# Altium schematic sheet VoltageRegulator5V.SchDoc
size A
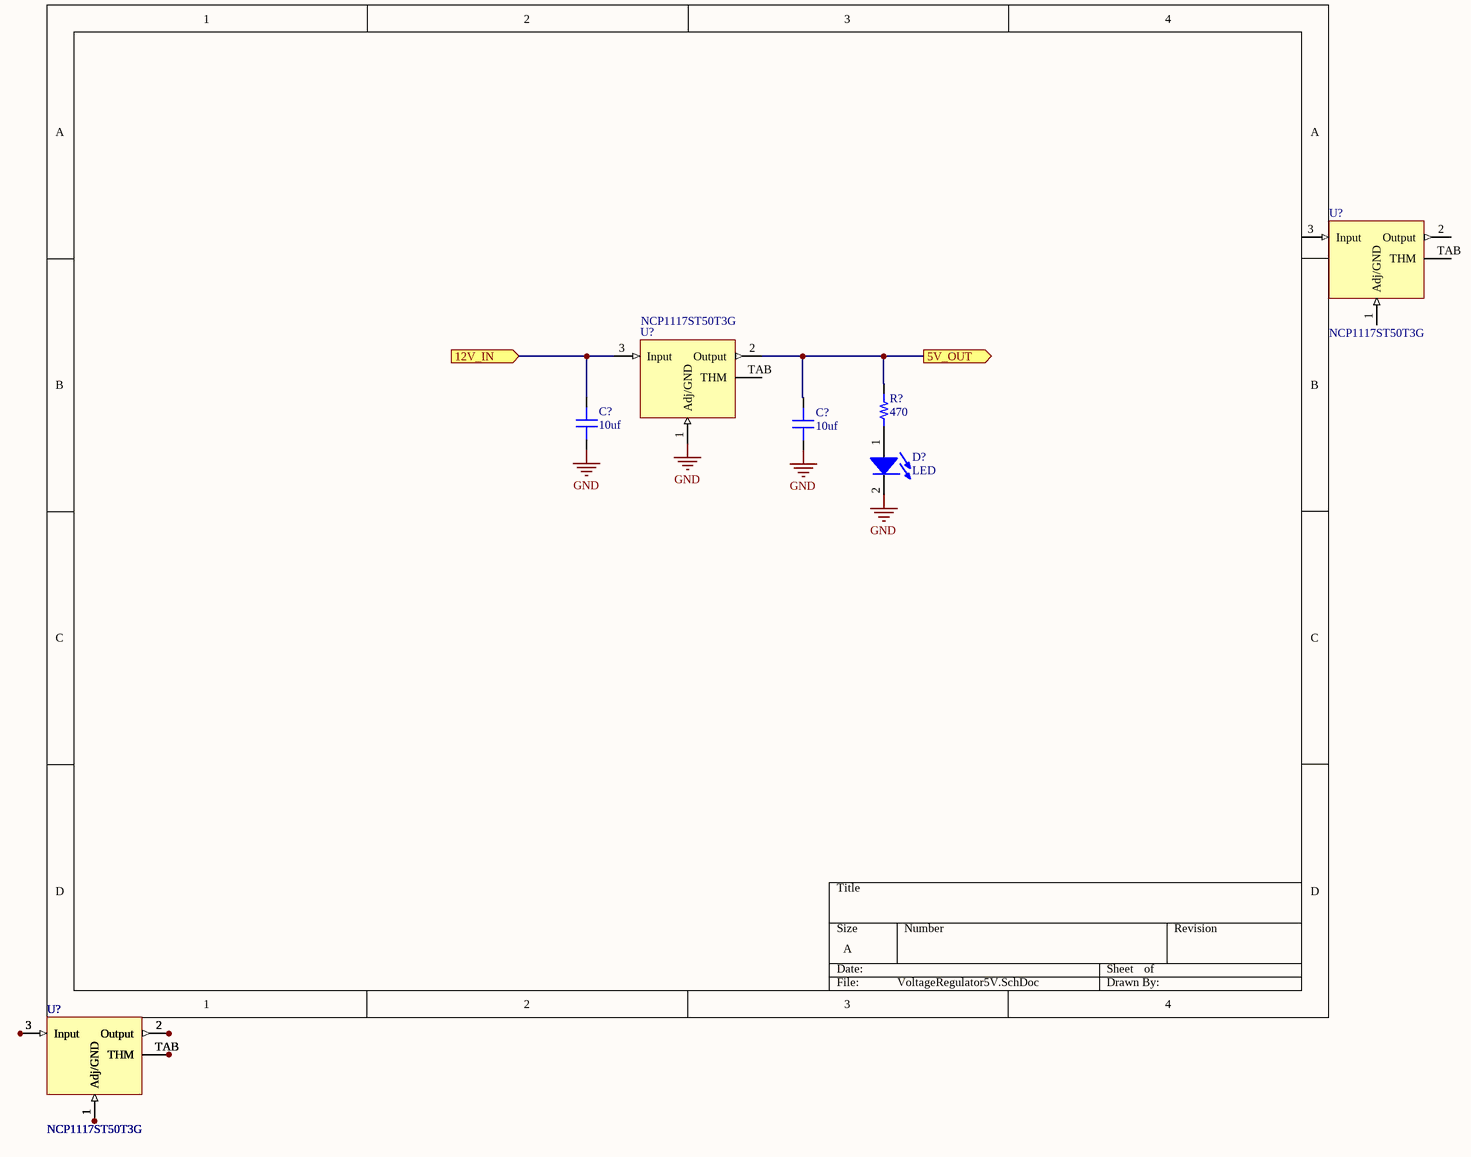
[diagram p0: VoltageRegulator5V.SchDoc]

## Parts
(Parts that share a designator on the sheet are numbered #1, #2 ... from top to bottom, then left to right.)
C?#1  value 10uf  [CAP 0603/1608]  (hidden comment: Capacitor MLCC 10uf 50V CAP 0603/1608)
C?#2  value 10uf  [CAP 0603/1608]  (hidden comment: Capacitor MLCC 10uf 50V CAP 0603/1608)
D?  LED  [0805_LED]
R?  value 470  [RES 0603/1608]  (hidden comment: Resistor 470 0603 1/10W 10%)
U?#1  NCP1117ST50T3G  [SOT-223-3]
U?#2  NCP1117ST50T3G  [SOT-223-3]
U?#3  NCP1117ST50T3G  [SOT-223-3]
U?#4  NCP1117ST50T3G  [SOT-223-3]
U?#5  NCP1117ST50T3G  [SOT-223-3]
U?#6  NCP1117ST50T3G  [SOT-223-3]
U?#7  NCP1117ST50T3G  [SOT-223-3]
U?#8  NCP1117ST50T3G  [SOT-223-3]

## Ports
5V_OUT (out), 12V_IN (in)

## Nets
GND: C?#1.2 C?#2.1 D?.2(K) U?#2.1(Adj/GND)
5V_OUT: C?#2.2 R?.1 U?#2.2(Output) ; port 5V_OUT
12V_IN: C?#1.1 U?#2.3(Input) ; port 12V_IN
NetD?_1: D?.1(A) R?.2
NetU?#3_1: U?#3.1(Adj/GND) U?#4.1(Adj/GND) U?#5.1(Adj/GND) U?#6.1(Adj/GND) U?#7.1(Adj/GND) U?#8.1(Adj/GND)
NetU?#3_2: U?#3.2(Output) U?#4.2(Output) U?#5.2(Output) U?#6.2(Output) U?#7.2(Output) U?#8.2(Output)
NetU?#3_3: U?#3.3(Input) U?#4.3(Input) U?#5.3(Input) U?#6.3(Input) U?#7.3(Input) U?#8.3(Input)
NetU?#3_TAB: U?#3.TAB(THM) U?#4.TAB(THM) U?#5.TAB(THM) U?#6.TAB(THM) U?#7.TAB(THM) U?#8.TAB(THM)

Not connected (* = marked no-connect by the designer): U?#1 1(Adj/GND) 2(Output) 3(Input) TAB(THM); U?#2 TAB(THM)

## Library data of the parts
C?#1 C?#2 = 955: Manufacturer_id: 1; idCapacitor: 955; Name: Cap_10uf_50V_CAP 0603/1608; Dielectric: Ceramic; Created_By: Nick Mah; Drawer_id: 1; Voltage_Rating: 50V; Package: CAP 0603/1608; Created_Date: 10/20/2018
D? = 2: Manufacturer_id: 1; idLED: 2; Name: CMD17_0805_GREEN; Value: Green; Brightness: 7mcd; Id: 20mA; Vf: 2.1V; Drawer_id: 1; Package: 0805; Link: https://www.digikey.com/product-detail/en/visual-communications-company-vcc/CMD17-21VGD-TR8/L62505CT-ND/254936
R? = 2301: Manufacturer_id: 1; idResistor: 2301; Name: Res_470_0603_1/10W_10%; Created_By: Nick Mah; Supplier 1: Digi-Key; Drawer_id: 1; Tolerance: 10%; Power: 1/10W; Package: 0603; ComponentLink1Description: Datasheet; Created_Date: 2018-10-20
U?#1-U?#8 = 16: Linear Voltage Regulator IC Positive Fixed 1 Output 5V 1A SOT-223; Manufacturer_id: 1; idPMIC_Lin: 16; Name: 5V 1A LDO; Value: 5V 1.0A; Output_Config: 5V Fixed; Vin(Max): 20V; Vout(Min): 4.95; Vout(Max): 5.05; Dropout_Voltage: 1.2V @ 800mA; Created_By: Angel Delgado; Drawer_id: 1; Num_Outputs: 1; Vout_Type: Fixed; Current_Rating: 1A; Package: SOT-223-3; MfrPartNo: NCP1117ST50T3G; Link: https://www.digikey.com/product-detail/en/on-semiconductor/NCP1117ST50T3G/NCP1117ST50T3GOSCT-ND/1967217; ComponentLink1Description: Datasheet; ComponentLink1URL: https://www.onsemi.com/pub/Collateral/NCP1117-D.PDF